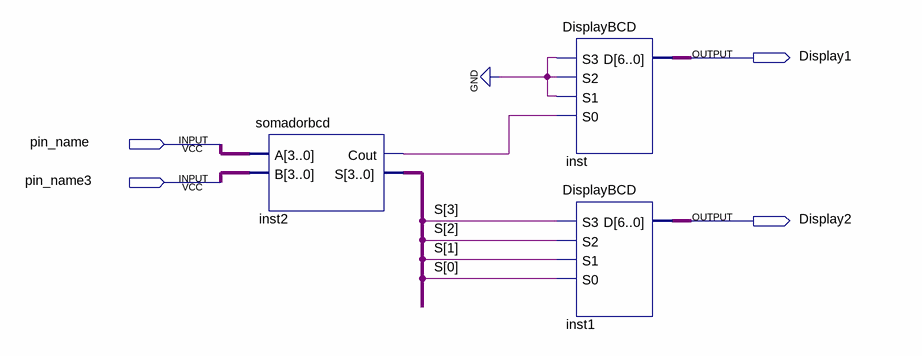
[diagram p0: schematic sheet]
// Quartus schematic SomadorBCD+Display.bdf as structural Verilog: 3 symbols, 4 pins
module \SomadorBCD+Display  (
  input  pin_name,
  input  pin_name3,
  output Display1,
  output Display2
);

  wire inst2_cout;
  wire [3:0] inst2_s, S, undriven, undriven_2;
  wire [6:0] inst1_d, inst_d;

  somadorbcd inst2 (.A(undriven), .B(undriven_2), .Cout(inst2_cout), .S(inst2_s));
  DisplayBCD inst (.S3(1'b0), .S2(1'b0), .S1(1'b0), .S0(inst2_cout), .D(inst_d));
  DisplayBCD inst1 (.S3(S[3]), .S2(S[2]), .S1(S[1]), .S0(S[0]), .D(inst1_d));
endmodule
